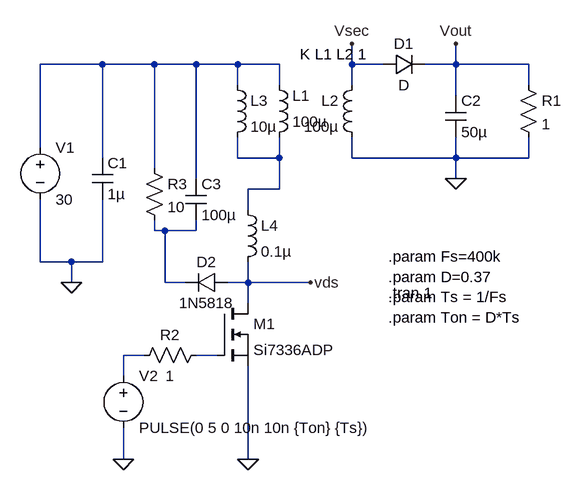
[diagram p0: schematic flyback.asc]
flyback.asc, the LTspice schematic file:
Version 4.1
SHEET 1 880 684
WIRE -16 32 -112 32
WIRE 64 32 -16 32
WIRE 128 32 64 32
WIRE 192 32 128 32
WIRE 256 32 192 32
WIRE 368 32 368 0
WIRE 416 32 368 32
WIRE 528 32 528 0
WIRE 528 32 480 32
WIRE 640 32 528 32
WIRE 192 64 192 32
WIRE 256 64 256 32
WIRE 368 64 368 32
WIRE 640 64 640 32
WIRE 528 80 528 32
WIRE -112 160 -112 32
WIRE -16 176 -16 32
WIRE 192 176 192 144
WIRE 256 176 256 144
WIRE 256 176 192 176
WIRE 368 176 368 144
WIRE 528 176 528 144
WIRE 528 176 368 176
WIRE 640 176 640 144
WIRE 640 176 528 176
WIRE 64 192 64 32
WIRE 128 208 128 32
WIRE 528 208 528 176
WIRE 256 224 256 176
WIRE 256 224 208 224
WIRE 208 256 208 224
WIRE 64 288 64 272
WIRE 80 288 64 288
WIRE 128 288 128 272
WIRE 128 288 80 288
WIRE -112 336 -112 240
WIRE -64 336 -112 336
WIRE -16 336 -16 240
WIRE -16 336 -64 336
WIRE -64 368 -64 336
WIRE 80 368 80 288
WIRE 112 368 80 368
WIRE 208 368 208 336
WIRE 208 368 176 368
WIRE 304 368 208 368
WIRE 208 400 208 368
WIRE 48 480 16 480
WIRE 160 480 128 480
WIRE 16 512 16 480
WIRE 16 640 16 592
WIRE 208 640 208 496
FLAG 208 640 0
FLAG 528 208 0
FLAG 528 0 Vout
FLAG 368 0 Vsec
FLAG 304 368 vds
FLAG 16 640 0
FLAG -64 368 0
SYMBOL voltage -112 144 R0
WINDOW 123 0 0 Left 0
WINDOW 39 0 0 Left 0
SYMATTR InstName V1
SYMATTR Value 30
SYMBOL cap -32 176 R0
SYMATTR InstName C1
SYMATTR Value 1µ
SYMBOL nmos 160 400 R0
SYMATTR InstName M1
SYMATTR Value Si7336ADP
SYMBOL ind 240 160 M180
WINDOW 0 36 80 Left 2
WINDOW 3 36 40 Left 2
SYMATTR InstName L1
SYMATTR Value 100µ
SYMATTR Type ind
SYMBOL ind 384 48 M0
SYMATTR InstName L2
SYMATTR Value 100µ
SYMATTR Type ind
SYMBOL ind 176 48 R0
SYMATTR InstName L3
SYMATTR Value 10µ
SYMBOL cap 512 80 R0
SYMATTR InstName C2
SYMATTR Value 50µ
SYMBOL res 624 48 R0
SYMATTR InstName R1
SYMATTR Value 1
SYMBOL ind 192 240 R0
SYMATTR InstName L4
SYMATTR Value 0.1µ
SYMBOL diode 416 48 R270
WINDOW 0 32 32 VTop 2
WINDOW 3 0 32 VBottom 2
SYMATTR InstName D1
SYMBOL voltage 16 496 R0
WINDOW 123 0 0 Left 0
WINDOW 39 0 0 Left 0
SYMATTR InstName V2
SYMATTR Value PULSE(0 5 0 10n 10n {Ton} {Ts})
SYMBOL res 144 464 R90
WINDOW 0 0 56 VBottom 2
WINDOW 3 32 56 VTop 2
SYMATTR InstName R2
SYMATTR Value 1
SYMBOL res 48 176 R0
SYMATTR InstName R3
SYMATTR Value 10
SYMBOL cap 112 208 R0
SYMATTR InstName C3
SYMATTR Value 100µ
SYMBOL diode 176 352 R90
WINDOW 0 0 32 VBottom 2
WINDOW 3 32 32 VTop 2
SYMATTR InstName D2
SYMATTR Value 1N5818
SYMATTR Description Diode
SYMATTR Type diode
TEXT 424 328 Left 2 !.param Fs=400k \n.param D=0.37\n.param Ts = 1/Fs\n.param Ton = D*Ts
TEXT 424 384 Left 2 !.tran 1
TEXT 288 16 Left 2 !K L1 L2 1

The netlist it stands for:
* flyback.asc
V1 N001 0 30
C1 N001 0 1µ
M1 vds N005 0 0 Si7336ADP
L1 N002 N001 100µ
L2 Vsec 0 100µ
L3 N001 N002 10µ
C2 Vout 0 50µ
R1 Vout 0 1
L4 N002 vds 0.1µ
D1 Vsec Vout D
V2 N004 0 PULSE(0 5 0 10n 10n {Ton} {Ts})
R2 N005 N004 1
R3 N001 N003 10
C3 N001 N003 100µ
D2 vds N003 1N5818
.model D D
.lib standard.dio
.model NMOS NMOS
.model PMOS PMOS
.lib standard.mos
.param Fs=400k
.param D=0.37
.param Ts = 1/Fs
.param Ton = D*Ts
.tran 1
K L1 L2 1
.backanno
.end